# Altium schematic sheet Pg02_ AM335X Section 1 .SchDoc: PROCESSOR 1 OF 1
size A2; DrawnBy: RvS; DocumentNumber: 2; SheetNumber: 2; SheetTotal: 16
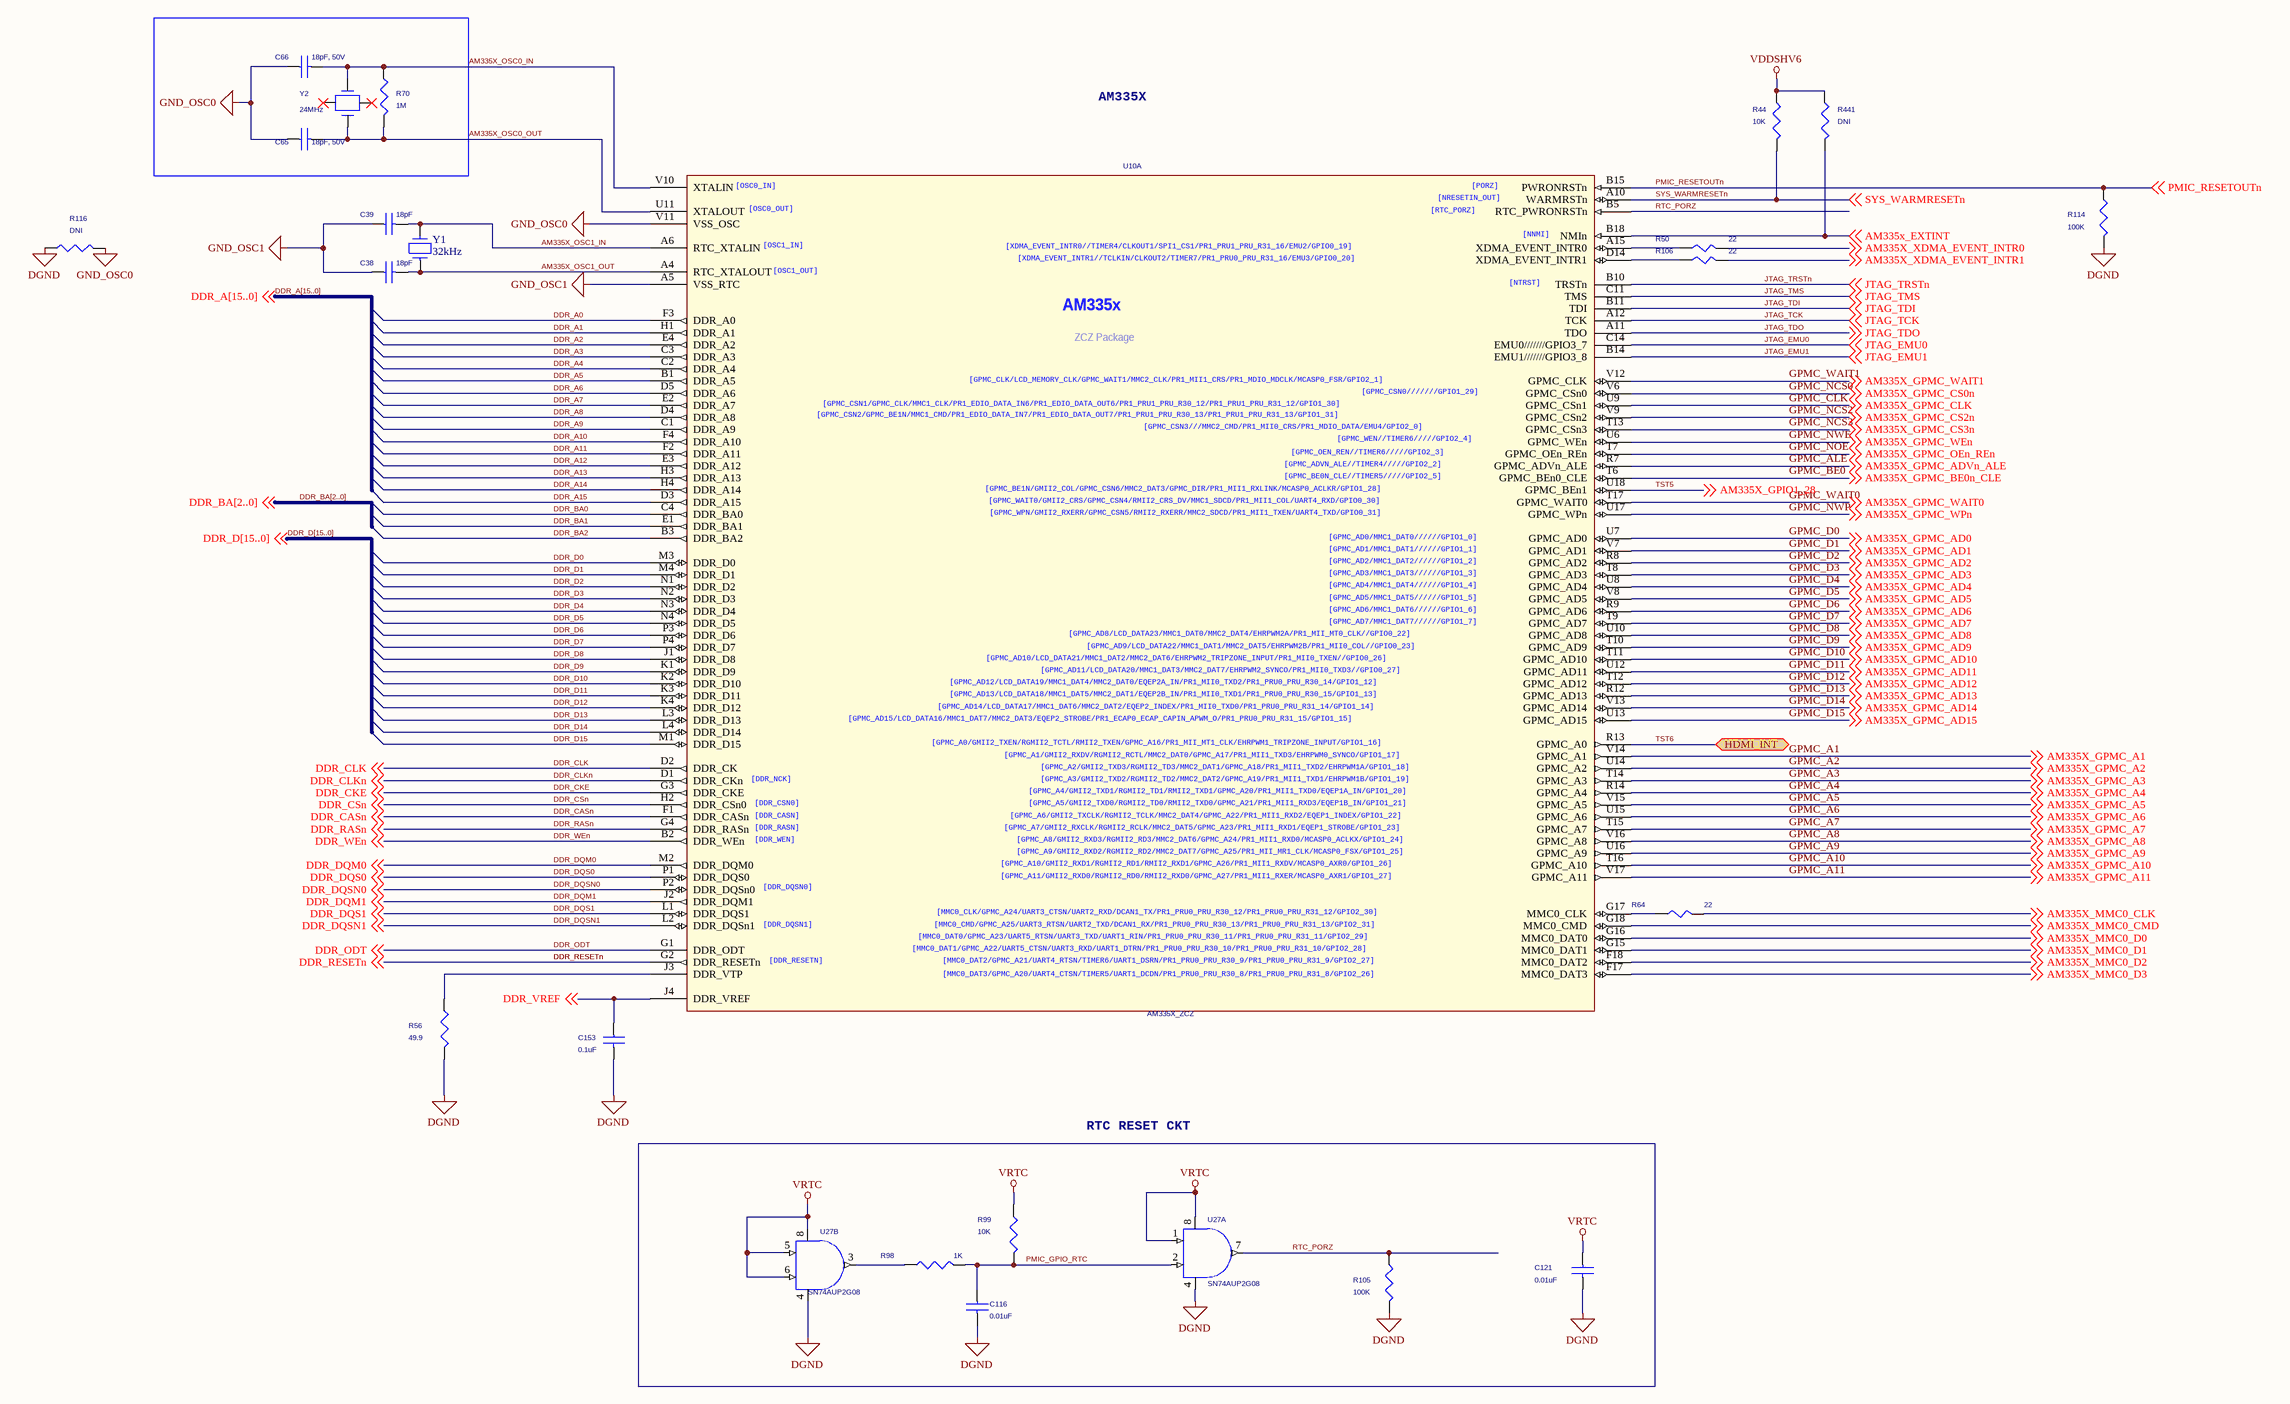
[diagram p0: Pg02_ AM335X Section 1 .SchDoc]

## Parts
?  (no value)  (graphical)
C38  18pF  [SM-7351-CAP-0402]
C39  18pF  [SM-7351-CAP-0402]
C65  18pF, 50V  [SM-7351-CAP-0402]
C66  18pF, 50V  [SM-7351-CAP-0402]
C116  0.01uF  [SM-7351-CAP-0402]
C121  0.01uF  [SM-7351-CAP-0402]
C153  0.1uF  [SM-7351-CAP-0402]
R44  10K  [SM-7351-RES-0402]
R50  22  [SM-7351-RES-0402]
R56  49.9  [smd_melf0102]
R64  22  [SM-7351-RES-0402]
R70  1M  [SM-7351-RES-0402]
R98  1K  [SM-7351-RES-0402]
R99  10K  [SM-7351-RES-0402]
R105  100K  [SM-7351-RES-0402]
R106  22  [SM-7351-RES-0402]
R114  100K  [SM-7351-RES-0402]
R116  DNI  [SM-7351-RES-0402]
R441  DNI  [SM-7351-RES-0402]
U10  AM335X_ZCZ  [BGA15X15-324-55M]  (part A of 3)
U27  SN74AUP2G08  [U_8_DCU]  (parts A,B of 2)
Y1  32kHz  [Xtal 3215]
Y2  24MHz  [XTAL4_3P2X2P5_SMD]

## Blocks framed on the sheet
RTC RESET CKT: C116 C121 R98 R99 R105 U27

## Ports
HDMI_INT

## Nets
DGND: C116.2 C121.2 C153.2 R56.1(P1) R105.1(P1) R114.1(P1) R116.2(P2) U27.4(GND)
GND_OSC0: C65.1 C66.1 R116.1(P1) U10.V11(VSS_OSC)
GND_OSC1: C38.1 C39.1 U10.A5(VSS_RTC)
VDDSHV6: R44.2(P2) R441.2(P2)
VRTC: C121.1 R99.2(P2) U27.1(2A) U27.5(2A) U27.6(2B) U27.8(VCC)
AM335x_EXTINT: R441.1(P1) U10.B18(NMIn) ; off-sheet AM335x_EXTINT
AM335X_MMC0_CLK: R64.1(P1) ; off-sheet AM335X_MMC0_CLK
AM335X_MMC0_CMD: U10.G18(MMC0_CMD) ; off-sheet AM335X_MMC0_CMD
AM335X_MMC0_D0: U10.G16(MMC0_DAT0) ; off-sheet AM335X_MMC0_D0
AM335X_MMC0_D1: U10.G15(MMC0_DAT1) ; off-sheet AM335X_MMC0_D1
AM335X_MMC0_D2: U10.F18(MMC0_DAT2) ; off-sheet AM335X_MMC0_D2
AM335X_MMC0_D3: U10.F17(MMC0_DAT3) ; off-sheet AM335X_MMC0_D3
AM335X_OSC0_IN: C66.2 R70.2(P2) U10.V10(XTALIN) Y2.3
AM335X_OSC0_OUT: C65.2 R70.1(P1) U10.U11(XTALOUT) Y2.1
AM335X_OSC1_IN: C39.2 U10.A6(RTC_XTALIN) Y1.2
AM335X_OSC1_OUT: C38.2 U10.A4(RTC_XTALOUT) Y1.1
AM335X_XDMA_EVENT_INTR0: R50.1(P1) ; off-sheet AM335X_XDMA_EVENT_INTR0
AM335X_XDMA_EVENT_INTR1: R106.1(P1) ; off-sheet AM335X_XDMA_EVENT_INTR1
DDR_A0: U10.F3(DDR_A0)
DDR_A1: U10.H1(DDR_A1)
DDR_A2: U10.E4(DDR_A2)
DDR_A3: U10.C3(DDR_A3)
DDR_A4: U10.C2(DDR_A4)
DDR_A5: U10.B1(DDR_A5)
DDR_A6: U10.D5(DDR_A6)
DDR_A7: U10.E2(DDR_A7)
DDR_A8: U10.D4(DDR_A8)
DDR_A9: U10.C1(DDR_A9)
DDR_A10: U10.F4(DDR_A10)
DDR_A11: U10.F2(DDR_A11)
DDR_A12: U10.E3(DDR_A12)
DDR_A13: U10.H3(DDR_A13)
DDR_A14: U10.H4(DDR_A14)
DDR_A15: U10.D3(DDR_A15)
DDR_BA0: U10.C4(DDR_BA0)
DDR_BA1: U10.E1(DDR_BA1)
DDR_BA2: U10.B3(DDR_BA2)
DDR_CASn: U10.F1(DDR_CASn) ; off-sheet DDR_CASn
DDR_CKE: U10.G3(DDR_CKE) ; off-sheet DDR_CKE
DDR_CLK: U10.D2(DDR_CK) ; off-sheet DDR_CLK
DDR_CLKn: U10.D1(DDR_CKn) ; off-sheet DDR_CLKn
DDR_CSn: U10.H2(DDR_CSn0) ; off-sheet DDR_CSn
DDR_D0: U10.M3(DDR_D0)
DDR_D1: U10.M4(DDR_D1)
DDR_D2: U10.N1(DDR_D2)
DDR_D3: U10.N2(DDR_D3)
DDR_D4: U10.N3(DDR_D4)
DDR_D5: U10.N4(DDR_D5)
DDR_D6: U10.P3(DDR_D6)
DDR_D7: U10.P4(DDR_D7)
DDR_D8: U10.J1(DDR_D8)
DDR_D9: U10.K1(DDR_D9)
DDR_D10: U10.K2(DDR_D10)
DDR_D11: U10.K3(DDR_D11)
DDR_D12: U10.K4(DDR_D12)
DDR_D13: U10.L3(DDR_D13)
DDR_D14: U10.L4(DDR_D14)
DDR_D15: U10.M1(DDR_D15)
DDR_DQM0: U10.M2(DDR_DQM0) ; off-sheet DDR_DQM0
DDR_DQM1: U10.J2(DDR_DQM1) ; off-sheet DDR_DQM1
DDR_DQS0: U10.P1(DDR_DQS0) ; off-sheet DDR_DQS0
DDR_DQS1: U10.L1(DDR_DQS1) ; off-sheet DDR_DQS1
DDR_DQSN0: U10.P2(DDR_DQSn0) ; off-sheet DDR_DQSN0
DDR_DQSN1: U10.L2(DDR_DQSn1) ; off-sheet DDR_DQSN1
DDR_ODT: U10.G1(DDR_ODT) ; off-sheet DDR_ODT
DDR_RASn: U10.G4(DDR_RASn) ; off-sheet DDR_RASn
DDR_RESETn: U10.G2(DDR_RESETn) ; off-sheet DDR_RESETn
DDR_VREF: C153.1 U10.J4(DDR_VREF) ; off-sheet DDR_VREF
DDR_WEn: U10.B2(DDR_WEn) ; off-sheet DDR_WEn
GPMC_A1: U10.V14(GPMC_A1) ; off-sheet AM335X_GPMC_A1  [also labelled AM335X_GPMC_A1]
GPMC_A2: U10.U14(GPMC_A2) ; off-sheet AM335X_GPMC_A2  [also labelled AM335X_GPMC_A2]
GPMC_A3: U10.T14(GPMC_A3) ; off-sheet AM335X_GPMC_A3  [also labelled AM335X_GPMC_A3]
GPMC_A4: U10.R14(GPMC_A4) ; off-sheet AM335X_GPMC_A4  [also labelled AM335X_GPMC_A4]
GPMC_A5: U10.V15(GPMC_A5) ; off-sheet AM335X_GPMC_A5  [also labelled AM335X_GPMC_A5]
GPMC_A6: U10.U15(GPMC_A6) ; off-sheet AM335X_GPMC_A6  [also labelled AM335X_GPMC_A6]
GPMC_A7: U10.T15(GPMC_A7) ; off-sheet AM335X_GPMC_A7  [also labelled AM335X_GPMC_A7]
GPMC_A8: U10.V16(GPMC_A8) ; off-sheet AM335X_GPMC_A8  [also labelled AM335X_GPMC_A8]
GPMC_A9: U10.U16(GPMC_A9) ; off-sheet AM335X_GPMC_A9  [also labelled AM335X_GPMC_A9]
GPMC_A10: U10.T16(GPMC_A10) ; off-sheet AM335X_GPMC_A10  [also labelled AM335X_GPMC_A10]
GPMC_A11: U10.V17(GPMC_A11) ; off-sheet AM335X_GPMC_A11  [also labelled AM335X_GPMC_A11]
GPMC_ALE: U10.R7(GPMC_ADVn_ALE) ; off-sheet AM335X_GPMC_ADVn_ALE  [also labelled AM335X_GPMC_ADVn_ALE]
GPMC_BE0: U10.T6(GPMC_BEn0_CLE) ; off-sheet AM335X_GPMC_BE0n_CLE  [also labelled AM335X_GPMC_BE0n_CLE]
GPMC_CLK: U10.U9(GPMC_CSn1) ; off-sheet AM335X_GPMC_CLK  [also labelled AM335X_GPMC_CLK]
GPMC_D0: U10.U7(GPMC_AD0) ; off-sheet AM335X_GPMC_AD0  [also labelled AM335X_GPMC_AD0]
GPMC_D1: U10.V7(GPMC_AD1) ; off-sheet AM335X_GPMC_AD1  [also labelled AM335X_GPMC_AD1]
GPMC_D2: U10.R8(GPMC_AD2) ; off-sheet AM335X_GPMC_AD2  [also labelled AM335X_GPMC_AD2]
GPMC_D3: U10.T8(GPMC_AD3) ; off-sheet AM335X_GPMC_AD3  [also labelled AM335X_GPMC_AD3]
GPMC_D4: U10.U8(GPMC_AD4) ; off-sheet AM335X_GPMC_AD4  [also labelled AM335X_GPMC_AD4]
GPMC_D5: U10.V8(GPMC_AD5) ; off-sheet AM335X_GPMC_AD5  [also labelled AM335X_GPMC_AD5]
GPMC_D6: U10.R9(GPMC_AD6) ; off-sheet AM335X_GPMC_AD6  [also labelled AM335X_GPMC_AD6]
GPMC_D7: U10.T9(GPMC_AD7) ; off-sheet AM335X_GPMC_AD7  [also labelled AM335X_GPMC_AD7]
GPMC_D8: U10.U10(GPMC_AD8) ; off-sheet AM335X_GPMC_AD8  [also labelled AM335X_GPMC_AD8]
GPMC_D9: U10.T10(GPMC_AD9) ; off-sheet AM335X_GPMC_AD9  [also labelled AM335X_GPMC_AD9]
GPMC_D10: U10.T11(GPMC_AD10) ; off-sheet AM335X_GPMC_AD10  [also labelled AM335X_GPMC_AD10]
GPMC_D11: U10.U12(GPMC_AD11) ; off-sheet AM335X_GPMC_AD11  [also labelled AM335X_GPMC_AD11]
GPMC_D12: U10.T12(GPMC_AD12) ; off-sheet AM335X_GPMC_AD12  [also labelled AM335X_GPMC_AD12]
GPMC_D13: U10.R12(GPMC_AD13) ; off-sheet AM335X_GPMC_AD13  [also labelled AM335X_GPMC_AD13]
GPMC_D14: U10.V13(GPMC_AD14) ; off-sheet AM335X_GPMC_AD14  [also labelled AM335X_GPMC_AD14]
GPMC_D15: U10.U13(GPMC_AD15) ; off-sheet AM335X_GPMC_AD15  [also labelled AM335X_GPMC_AD15]
GPMC_NCS0: U10.V6(GPMC_CSn0) ; off-sheet AM335X_GPMC_CS0n  [also labelled AM335X_GPMC_CS0n]
GPMC_NCS2: U10.V9(GPMC_CSn2) ; off-sheet AM335X_GPMC_CS2n  [also labelled AM335X_GPMC_CS2n]
GPMC_NCS3: U10.T13(GPMC_CSn3) ; off-sheet AM335X_GPMC_CS3n  [also labelled AM335X_GPMC_CS3n]
GPMC_NOE: U10.T7(GPMC_OEn_REn) ; off-sheet AM335X_GPMC_OEn_REn  [also labelled AM335X_GPMC_OEn_REn]
GPMC_NWE: U10.U6(GPMC_WEn) ; off-sheet AM335X_GPMC_WEn  [also labelled AM335X_GPMC_WEn]
GPMC_NWP: U10.U17(GPMC_WPn) ; off-sheet AM335X_GPMC_WPn  [also labelled AM335X_GPMC_WPn]
GPMC_WAIT0: U10.T17(GPMC_WAIT0) ; off-sheet AM335X_GPMC_WAIT0  [also labelled AM335X_GPMC_WAIT0]
GPMC_WAIT1: U10.V12(GPMC_CLK) ; off-sheet AM335X_GPMC_WAIT1  [also labelled AM335X_GPMC_WAIT1]
JTAG_EMU0: U10.C14(EMU0///////GPIO3_7) ; off-sheet JTAG_EMU0
JTAG_EMU1: U10.B14(EMU1///////GPIO3_8) ; off-sheet JTAG_EMU1
JTAG_TCK: U10.A12(TCK) ; off-sheet JTAG_TCK
JTAG_TDI: U10.B11(TDI) ; off-sheet JTAG_TDI
JTAG_TDO: U10.A11(TDO) ; off-sheet JTAG_TDO
JTAG_TMS: U10.C11(TMS) ; off-sheet JTAG_TMS
JTAG_TRSTn: U10.B10(TRSTn) ; off-sheet JTAG_TRSTn
PMIC_GPIO_RTC: C116.1 R98.1(P1) R99.1(P1) U27.2(2B)
PMIC_RESETOUTn: R114.2(P2) U10.B15(PWRONRSTn) ; off-sheet PMIC_RESETOUTn
RTC_PORZ: R105.2(P2) U10.B5(RTC_PWRONRSTn) U27.7(2Y)
SYS_WARMRESETn: R44.1(P1) U10.A10(WARMRSTn) ; off-sheet SYS_WARMRESETn
TST5: U10.U18(GPMC_BEn1) ; off-sheet AM335X_GPIO1_28  [also labelled AM335X_GPIO1_28]
TST6: U10.R13(GPMC_A0) ; port HDMI_INT
NetR50_2: R50.2(P2) U10.A15(XDMA_EVENT_INTR0)
NetR56_2: R56.2(P2) U10.J3(DDR_VTP)
NetR64_2: R64.2(P2) U10.G17(MMC0_CLK)
NetR98_2: R98.2(P2) U27.3(2Y)
NetR106_2: R106.2(P2) U10.D14(XDMA_EVENT_INTR1)

Not connected (* = marked no-connect by the designer): Y2 2(NC0)* 4(NC1)*

## Buses and harness runs
bus DDR_A[15..0]
bus DDR_BA[2..0]
bus DDR_D[15..0]

## Notes on the sheet
- AM335X
- Embedded Vision Systems Group
- Title
- School of Electrical and Electronic Engineering
- Date:
- Size
- Document Number
- Sheet
- of
- Rev
- (in symbol AM335X_15mmx15mm, part A) [OSC0_IN]; [PORZ]; [NRESETIN_OUT]; [OSC0_OUT]; [RTC_PORZ]; [NNMI]; [OSC1_IN]; [XDMA_EVENT_INTR0//TIMER4/CLKOUT1/SPI1_CS1/PR1_PRU1_PRU_R31_16/EMU2/GPIO0_19]; [XDMA_EVENT_INTR1//TCLKIN/CLKOUT2/TIMER7/PR1_PRU0_PRU_R31_16/EMU3/GPIO0_20]; [OSC1_OUT]; [NTRST]; AM335x; ZCZ Package; [GPMC_CLK/LCD_MEMORY_CLK/GPMC_WAIT1/MMC2_CLK/PR1_MII1_CRS/PR1_MDIO_MDCLK/MCASP0_FSR/GPIO2_1]; [GPMC_CSN0///////GPIO1_29]; [GPMC_CSN1/GPMC_CLK/MMC1_CLK/PR1_EDIO_DATA_IN6/PR1_EDIO_DATA_OUT6/PR1_PRU1_PRU_R30_12/PR1_PRU1_PRU_R31_12/GPIO1_30]; [GPMC_CSN2/GPMC_BE1N/MMC1_CMD/PR1_EDIO_DATA_IN7/PR1_EDIO_DATA_OUT7/PR1_PRU1_PRU_R30_13/PR1_PRU1_PRU_R31_13/GPIO1_31]; [GPMC_CSN3///MMC2_CMD/PR1_MII0_CRS/PR1_MDIO_DATA/EMU4/GPIO2_0]; [GPMC_WEN//TIMER6/////GPIO2_4]; [GPMC_OEN_REN//TIMER6/////GPIO2_3]; [GPMC_ADVN_ALE//TIMER4/////GPIO2_2]; [GPMC_BE0N_CLE//TIMER5/////GPIO2_5]; [GPMC_BE1N/GMII2_COL/GPMC_CSN6/MMC2_DAT3/GPMC_DIR/PR1_MII1_RXLINK/MCASP0_ACLKR/GPIO1_28]; [GPMC_WAIT0/GMII2_CRS/GPMC_CSN4/RMII2_CRS_DV/MMC1_SDCD/PR1_MII1_COL/UART4_RXD/GPIO0_30]; [GPMC_WPN/GMII2_RXERR/GPMC_CSN5/RMII2_RXERR/MMC2_SDCD/PR1_MII1_TXEN/UART4_TXD/GPIO0_31]; [GPMC_AD0/MMC1_DAT0//////GPIO1_0]; [GPMC_AD1/MMC1_DAT1//////GPIO1_1]; [GPMC_AD2/MMC1_DAT2//////GPIO1_2]; [GPMC_AD3/MMC1_DAT3//////GPIO1_3]; [GPMC_AD4/MMC1_DAT4//////GPIO1_4]; [GPMC_AD5/MMC1_DAT5//////GPIO1_5]; [GPMC_AD6/MMC1_DAT6//////GPIO1_6]; [GPMC_AD7/MMC1_DAT7//////GPIO1_7]; [GPMC_AD8/LCD_DATA23/MMC1_DAT0/MMC2_DAT4/EHRPWM2A/PR1_MII_MT0_CLK//GPIO0_22]; [GPMC_AD9/LCD_DATA22/MMC1_DAT1/MMC2_DAT5/EHRPWM2B/PR1_MII0_COL//GPIO0_23]; [GPMC_AD10/LCD_DATA21/MMC1_DAT2/MMC2_DAT6/EHRPWM2_TRIPZONE_INPUT/PR1_MII0_TXEN//GPIO0_26]; [GPMC_AD11/LCD_DATA20/MMC1_DAT3/MMC2_DAT7/EHRPWM2_SYNCO/PR1_MII0_TXD3//GPIO0_27]; [GPMC_AD12/LCD_DATA19/MMC1_DAT4/MMC2_DAT0/EQEP2A_IN/PR1_MII0_TXD2/PR1_PRU0_PRU_R30_14/GPIO1_12]; [GPMC_AD13/LCD_DATA18/MMC1_DAT5/MMC2_DAT1/EQEP2B_IN/PR1_MII0_TXD1/PR1_PRU0_PRU_R30_15/GPIO1_13]; [GPMC_AD14/LCD_DATA17/MMC1_DAT6/MMC2_DAT2/EQEP2_INDEX/PR1_MII0_TXD0/PR1_PRU0_PRU_R31_14/GPIO1_14]; [GPMC_AD15/LCD_DATA16/MMC1_DAT7/MMC2_DAT3/EQEP2_STROBE/PR1_ECAP0_ECAP_CAPIN_APWM_O/PR1_PRU0_PRU_R31_15/GPIO1_15]; [GPMC_A0/GMII2_TXEN/RGMII2_TCTL/RMII2_TXEN/GPMC_A16/PR1_MII_MT1_CLK/EHRPWM1_TRIPZONE_INPUT/GPIO1_16]; [GPMC_A1/GMII2_RXDV/RGMII2_RCTL/MMC2_DAT0/GPMC_A17/PR1_MII1_TXD3/EHRPWM0_SYNCO/GPIO1_17]; [GPMC_A2/GMII2_TXD3/RGMII2_TD3/MMC2_DAT1/GPMC_A18/PR1_MII1_TXD2/EHRPWM1A/GPIO1_18]; [DDR_NCK]; [GPMC_A3/GMII2_TXD2/RGMII2_TD2/MMC2_DAT2/GPMC_A19/PR1_MII1_TXD1/EHRPWM1B/GPIO1_19]; [GPMC_A4/GMII2_TXD1/RGMII2_TD1/RMII2_TXD1/GPMC_A20/PR1_MII1_TXD0/EQEP1A_IN/GPIO1_20]; [DDR_CSN0]; [GPMC_A5/GMII2_TXD0/RGMII2_TD0/RMII2_TXD0/GPMC_A21/PR1_MII1_RXD3/EQEP1B_IN/GPIO1_21]; [DDR_CASN]; [GPMC_A6/GMII2_TXCLK/RGMII2_TCLK/MMC2_DAT4/GPMC_A22/PR1_MII1_RXD2/EQEP1_INDEX/GPIO1_22]; [DDR_RASN]; [GPMC_A7/GMII2_RXCLK/RGMII2_RCLK/MMC2_DAT5/GPMC_A23/PR1_MII1_RXD1/EQEP1_STROBE/GPIO1_23]; [DDR_WEN]; [GPMC_A8/GMII2_RXD3/RGMII2_RD3/MMC2_DAT6/GPMC_A24/PR1_MII1_RXD0/MCASP0_ACLKX/GPIO1_24]; [GPMC_A9/GMII2_RXD2/RGMII2_RD2/MMC2_DAT7/GPMC_A25/PR1_MII_MR1_CLK/MCASP0_FSX/GPIO1_25]; [GPMC_A10/GMII2_RXD1/RGMII2_RD1/RMII2_RXD1/GPMC_A26/PR1_MII1_RXDV/MCASP0_AXR0/GPIO1_26]; [GPMC_A11/GMII2_RXD0/RGMII2_RD0/RMII2_RXD0/GPMC_A27/PR1_MII1_RXER/MCASP0_AXR1/GPIO1_27]; [DDR_DQSN0]; [MMC0_CLK/GPMC_A24/UART3_CTSN/UART2_RXD/DCAN1_TX/PR1_PRU0_PRU_R30_12/PR1_PRU0_PRU_R31_12/GPIO2_30]; [DDR_DQSN1]; [MMC0_CMD/GPMC_A25/UART3_RTSN/UART2_TXD/DCAN1_RX/PR1_PRU0_PRU_R30_13/PR1_PRU0_PRU_R31_13/GPIO2_31]; [MMC0_DAT0/GPMC_A23/UART5_RTSN/UART3_TXD/UART1_RIN/PR1_PRU0_PRU_R30_11/PR1_PRU0_PRU_R31_11/GPIO2_29]; [MMC0_DAT1/GPMC_A22/UART5_CTSN/UART3_RXD/UART1_DTRN/PR1_PRU0_PRU_R30_10/PR1_PRU0_PRU_R31_10/GPIO2_28]; [DDR_RESETN]; [MMC0_DAT2/GPMC_A21/UART4_RTSN/TIMER6/UART1_DSRN/PR1_PRU0_PRU_R30_9/PR1_PRU0_PRU_R31_9/GPIO2_27]; [MMC0_DAT3/GPMC_A20/UART4_CTSN/TIMER5/UART1_DCDN/PR1_PRU0_PRU_R30_8/PR1_PRU0_PRU_R31_8/GPIO2_26]

## Library data of the parts
? = Title Block Address(1): UoM title block
C38 C39 = 22pFCapacitor50V10%SMD0402: Capacitor 22pF 50V 10% 0402; PartName: 22pF50V10%SMD0402; Mfr: Panasonic; MfrNum: ECJ-0EC1H220J; TIIntPartnumber: 1C0020; Vendor: Digikey; Cost100: 0.1678; DescriptiveText: Capacitor 22pF 50V 10% 0402; Cost10K: 0.1678; Descriptive_Text: Capacitor 22pF 50V 10% 0402
C65 C66 = 18pFCapacitor50V5%0402: PartName: 18pF50V5%SMD0402; Mfr: TDK; MfrNum: CGA2B2C0G1H180J; TIIntPartnumber: 1C0119; Vendor: Mouser; Cost100: 0.19; Cost10K: 0.045; DescriptiveText: Capacitor NPO 18pF 50V 5% 0402
C116 C121 = 0.01uFCapacitor16V10%0402: Mfr: Panasonic; PartName: 0.01uF16V10%SMD0402; MfrNum: ECJ-0YB1C103K; TIIntPartnumber: 1C0012; PN: 0402YC103KAT2A; TN: 207-0054-000; Vendor: Digikey; Cost100: 0.00; Cost10K: 0.015; DescriptiveText: Capacitor 0.01uF 16V 10% 0402
C153 = 0.1uFCapacitor16V10%0402_Dup1: TIIntPartnumber: 1C0089; MfrNum: C0402C104K4RACT; Mfr: Kemet; PartName: 0.1uF16V10%SMD0402; DescriptiveText: Capacitor 0.1uF 16V 10% 0402 X7R; Cost10K: 0.015; Cost100: 0.11; Vendor: Digikey
R44 R441 = 10KOhmResistor1/16W0402_Dup1: Resistor 10Kohm 1/16W 5% 0402; TIIntPartnumber: 1R0168; MfrNum: MCR01MZPJ103; Mfr: Rohm; PartName: 10Kohm1/16W5%SMD0402; Cost10K: 0.0017; Cost100: 0.03; Vendor: Digikey; Descriptive_Text: Resistor 10Kohm 1/16W 5% 0402; DescriptiveText: Resistor 10Kohm 1/16W 5% 0402
R50 R64 R106 = 22OhmResistor1/16W1%0402: Resistor 22 ohm 1/16W 1% 0402; PartName: 22ohm1/161%smd0402; Mfr: ROHM; MfrNum: MCR01MZPF22R0; TIIntPartnumber: 1R0175; Vendor: Digikey; Cost100: 0.069; Cost10K: 0.00529; DescriptiveText: Resistor 22 ohm 1/16W 1% 0402; Descriptive_Text: Resistor 22 ohm 1/16W 1% 0402
R56 = 49.9ohm1/3W1%SMDMELF0102: Mfr: Vishay; MfrNum: MMU01020C4999FB300; TIIntPartnumber: 1R0243; DescriptiveText: MELF Resistor 49.9ohm 1/3W 1% MELF0102; Vendor: Digikey; Cost100: 0.0105; Cost10K: 0.00275; PartName: 49.9ohm1/3W1%smdMELF0102
R70 R116 = 1MOhmResistor1/16W0402: PartName: 1Mohm1/16W1%SMD0402; Mfr: Stackpole Electronics; MfrNum: RMCF0402FT1M00; TIIntPartnumber: 1R0182; Vendor: Digikey; Cost100: 0.0105; Cost10K: 0.00275; DescriptiveText: Resistor 1Mohm 1/16W 1% 0402
R98 = 1KOhmResistor1/16W0402: Resistor 1Kohm 1/16W 5% 0402; PartName: 1KOHM1/16W5%SMD; Mfr: Panasonic; MfrNum: ERJ-2GEJ102X; TIIntPartnumber: 1R0027; Vendor: DIGIKEY; Cost100: 0.02595; Descriptive_Text: Resistor 1Kohm 1/16W 5% 0402; Cost10K: 0.02595; DescriptiveText: Resistor 1Kohm 1/16W 5% 0402
R99 = 10KOhmResistor1/16W0402: Resistor 10Kohm 1/16W 5% 0402; PartName: 10Kohm1/16W5%SMD0402; Mfr: Rohm; MfrNum: MCR01MZPJ103; TIIntPartnumber: 1R0168; Vendor: DIGIKEY; Cost100: 0.03; Cost10K: 0.0017; DescriptiveText: Resistor 10Kohm 1/16W 5% 0402; Descriptive_Text: Resistor 10Kohm 1/16W 5% 0402
R105 R114 = 100KOhmResistor1/16W0402: TIIntPartnumber: 1R0181; MfrNum: RMCF0402FT100K; Mfr: Stackpole Electronics; PartName: 100Kohm1/16W1%SMD0402; DescriptiveText: Resistor 100Kohm 1/16W 1% 0402; Cost10K: 0.0020; Cost100: 0.0105; Vendor: DIGIKEY
U10 = AM335X_15mmx15mm: TIIntPartnumber: 1A0242; MfrNum: XAM3359ZCZ; Mfr: TI; PartName: AM335X_15x15; Cost10K: 4.1; Cost100: 10.00; Vendor: Arrow; DescriptiveText: ARM MPU Cortex A8 Processor ZCZ Package
U27 = SN74AUP2G08: Low Power Dual AND Gate; TIIntPartnumber: 1A0249; MfrNum: SN74AUP2G08DCU; Mfr: TI; Cost10K: 0.1710; Cost100: 0.11; Vendor: Digikey; Descriptive_Text: Low Power Dual AND Gate; PartName: SN74AUP2G08; DescriptiveText: Low Power Dual AND Gate
Y1 = CRYSTAL
Y2 = Crystal24MHz18PFsmd_0: PartName: Crystal24MHz3.2x2.5; Mfr: Citizen; MfrNum: CS325-24.000MABJ-UT; TIIntPartnumber: 1Y0039; DescriptiveText: Crystal 24MHz 30ppm load cap 18pF; Vendor: Digikey; Cost100: 0.56; Cost10K: 0.50